# Altium project PCB_Project-LEDs.PrjPCB
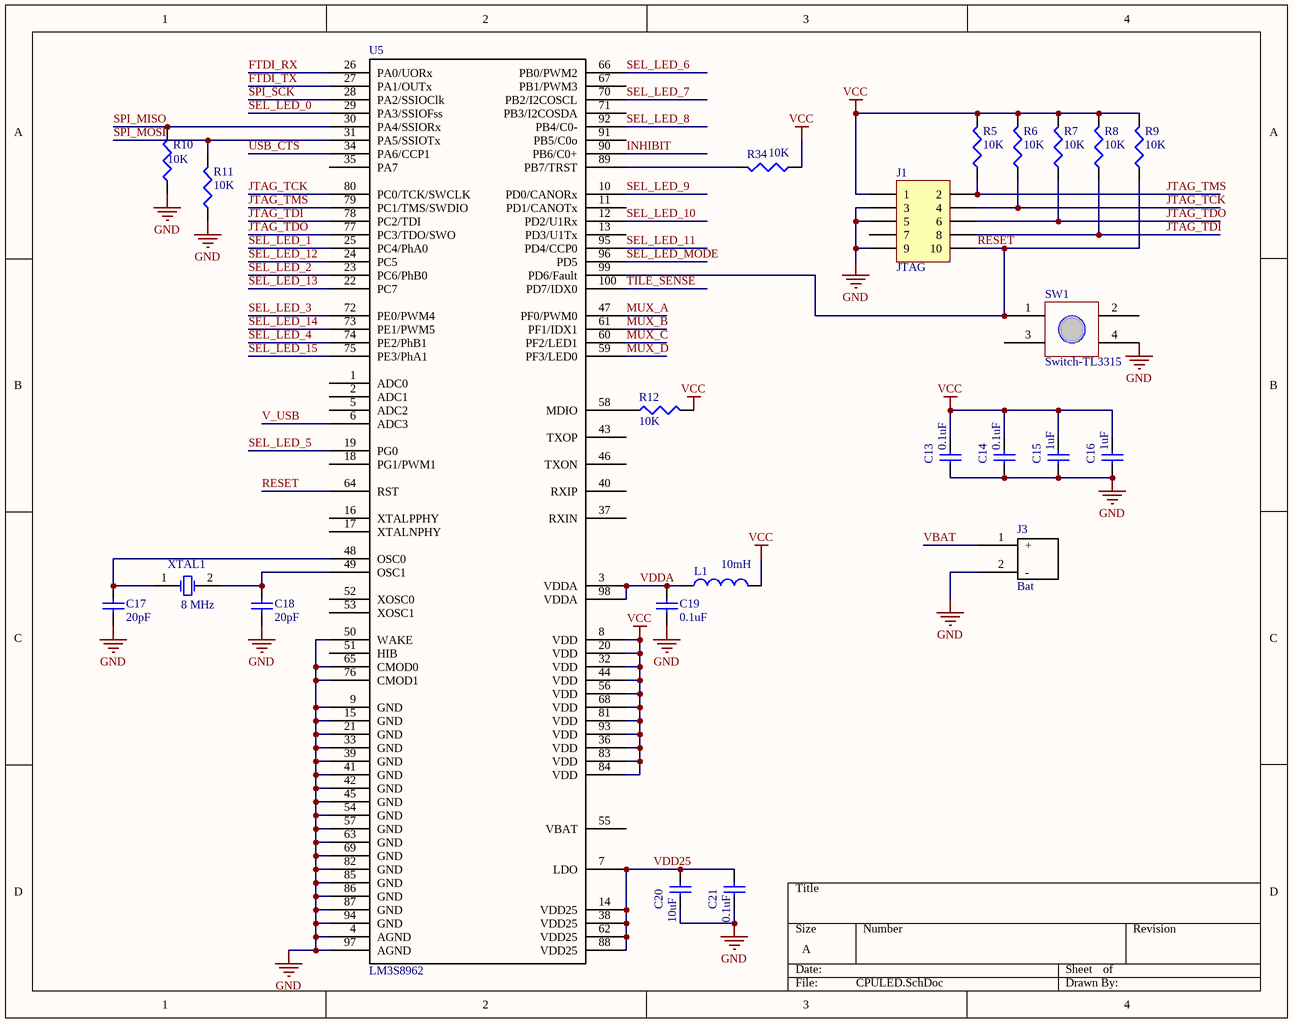
[diagram p0: CPULED.SchDoc]
3 sheets, 66 parts. Net scope: global (net labels, ports and power ports of the same name join across sheets).
Board file: LED_PCB.PcbDoc
Sheets:
  CPULED.SchDoc
  GREENLED.SchDoc
  POWER.SchDoc

## Sheet CPULED.SchDoc
size A

### Parts
C13  value 0.1uF  [CAPC1005L]  (hidden comment: Cap Semi)
C14  value 0.1uF  [CAPC1005L]  (hidden comment: Cap Semi)
C15  value 1uF  [CAPC1608L]  (hidden comment: Cap Semi)
C16  value 1uF  [CAPC1608L]  (hidden comment: Cap Semi)
C17  value 20pF  [CAPC1005L]  (hidden comment: Cap Semi)
C18  value 20pF  [CAPC1005L]  (hidden comment: Cap Semi)
C19  value 0.1uF  [CAPC1005L]  (hidden comment: Cap Semi)
C20  value 10uF  [CAPC1608L]  (hidden comment: Cap Semi)
C21  value 0.1uF  [CAPC1005L]  (hidden comment: Cap Semi)
J1  JTAG  [JTAG-10]
J3  Bat  [BatteryConnJST]
L1  value 10mH  [INDC2012L]  (hidden comment: Inductor)
R5  value 10K  [RESC1608L]  (hidden comment: Res3)
R6  value 10K  [RESC1608L]  (hidden comment: Res3)
R7  value 10K  [RESC1608L]  (hidden comment: Res3)
R8  value 10K  [RESC1608L]  (hidden comment: Res3)
R9  value 10K  [RESC1608L]  (hidden comment: Res3)
R10  value 10K  [RESC1608L]  (hidden comment: Res3)
R11  value 10K  [RESC1608L]  (hidden comment: Res3)
R12  value 10K  [RESC1608L]  (hidden comment: Res3)
R34  value 10K  [RESC1608L]  (hidden comment: Res3)
SW1  Switch-TL3315  [Switch-TL3315]
U5  LM3S8962  [LQFP-100]
XTAL1  8 MHz  [RESC5025L]

### Nets
GND: C13.1 C14.1 C15.1 C16.1 C17.1 C18.1 C19.1 C20.1 C21.1 J1.3 J1.5 J1.9 J3.2(-) R10.1 R11.1 SW1.4 U5.4(AGND) U5.9(GND) U5.15(GND) U5.21(GND) U5.33(GND) U5.39(GND) U5.41(GND) U5.42(GND) U5.45(GND) U5.50(WAKE) U5.54(GND) U5.57(GND) U5.63(GND) U5.65(CMOD0) U5.69(GND) U5.76(CMOD1) U5.82(GND) U5.85(GND) U5.86(GND) U5.87(GND) U5.94(GND) U5.97(AGND)
VCC: C13.2 C14.2 C15.2 C16.2 J1.1 L1.2 R5.2 R6.2 R7.2 R8.2 R9.2 R12.2 R34.1 U5.8(VDD) U5.20(VDD) U5.32(VDD) U5.36(VDD) U5.44(VDD) U5.56(VDD) U5.68(VDD) U5.81(VDD) U5.83(VDD) U5.84(VDD) U5.93(VDD)
FTDI_RX: U5.26(PA0/UORx)
FTDI_TX: U5.27(PA1/OUTx)
INHIBIT: U5.90(PB6/C0+)
JTAG_TCK: J1.4 R6.1 U5.80(PC0/TCK/SWCLK)
JTAG_TDI: J1.8 R8.1 U5.78(PC2/TDI)
JTAG_TDO: J1.6 R7.1 U5.77(PC3/TDO/SWO)
JTAG_TMS: J1.2 R5.1 U5.79(PC1/TMS/SWDIO)
MUX_A: U5.47(PF0/PWM0)
MUX_B: U5.61(PF1/IDX1)
MUX_C: U5.60(PF2/LED1)
MUX_D: U5.59(PF3/LED0)
RESET: J1.10 R9.1 SW1.1 U5.64(RST) U5.99(PD6/Fault)
SEL_LED_0: U5.29(PA3/SSIOFss)
SEL_LED_1: U5.25(PC4/PhA0)
SEL_LED_2: U5.23(PC6/PhB0)
SEL_LED_3: U5.72(PE0/PWM4)
SEL_LED_4: U5.74(PE2/PhB1)
SEL_LED_5: U5.19(PG0)
SEL_LED_6: U5.66(PB0/PWM2)
SEL_LED_7: U5.70(PB2/I2COSCL)
SEL_LED_8: U5.92(PB4/C0-)
SEL_LED_9: U5.10(PD0/CANORx)
SEL_LED_10: U5.12(PD2/U1Rx)
SEL_LED_11: U5.95(PD4/CCP0)
SEL_LED_12: U5.24(PC5)
SEL_LED_13: U5.22(PC7)
SEL_LED_14: U5.73(PE1/PWM5)
SEL_LED_15: U5.75(PE3/PhA1)
SEL_LED_MODE: U5.96(PD5)
SPI_MISO: R10.2 U5.30(PA4/SSIORx)
SPI_MOSI: R11.2 U5.31(PA5/SSIOTx)
SPI_SCK: U5.28(PA2/SSIOClk)
TILE_SENSE: U5.100(PD7/IDX0)
USB_CTS: U5.34(PA6/CCP1)
V_USB: U5.6(ADC3)
VBAT: J3.1(+)
VDD25: C20.2 C21.2 U5.7(LDO) U5.14(VDD25) U5.38(VDD25) U5.62(VDD25) U5.88(VDD25)
VDDA: C19.2 L1.1 U5.3(VDDA) U5.98(VDDA)
NetC17_2: C17.2 U5.48(OSC0) XTAL1.1(OSC1)
NetC18_2: C18.2 U5.49(OSC1) XTAL1.2(OSC2)
NetR12_1: R12.1 U5.58(MDIO)
NetR34_2: R34.2 U5.89(PB7/TRST)

Not connected (* = marked no-connect by the designer): J1 7; SW1 2 3; U5 1(ADC0) 2(ADC1) 5(ADC2) 11(PD1/CANOTx) 13(PD3/U1Tx) 16(XTALPPHY) 17(XTALNPHY) 18(PG1/PWM1) 35(PA7) 37(RXIN) 40(RXIP) 43(TXOP) 46(TXON) 51(HIB) 52(XOSC0) 53(XOSC1) 55(VBAT) 67(PB1/PWM3) 71(PB3/I2COSDA) 91(PB5/C0o)

### Library data of the parts
C13-C21 = Cap Semi: Capacitor (Semiconductor SIM Model); Published: 8-Jun-2000; LatestRevisionDate: 29-May-2009; LatestRevisionNote: IPC-7351 Footprint Added.; PackageReference: C1206; Publisher: Altium Limited; PackageDescription: Chip Capacitor
J1 = Header 5X2H: Header, 5-Pin, Dual row, Right Angle; LatestRevisionDate: 17-Jul-2002; LatestRevisionNote: Re-released for DXP Platform.; Publisher: Altium Limited
J3 = BatteryConnJST
L1 = Inductor: Code_IEC: 1005; Published: 8-Jun-2000; LatestRevisionDate: 29-May-2009; LatestRevisionNote: IPC-7351 Footprint Added.; PackageReference: 0402-A; Publisher: Altium Limited; PackageDescription: Chip Inductor; Code_JEITA: 0402
R5-R12 R34 = Res3: Resistor; Published: 8-Jun-2000; LatestRevisionDate: 29-May-2009; LatestRevisionNote: IPC-7351 Footprint Added.; PackageReference: J1-0603; Publisher: Altium Limited; PackageDescription: Chip Resistor
XTAL1 = XTAL: Crystal Oscillator; Published: 8-Jun-2000; LatestRevisionDate: 17-Jul-2002; LatestRevisionNote: Re-released for DXP Platform.; PackageReference: R38; Publisher: Altium Limited

## Sheet GREENLED.SchDoc
size A
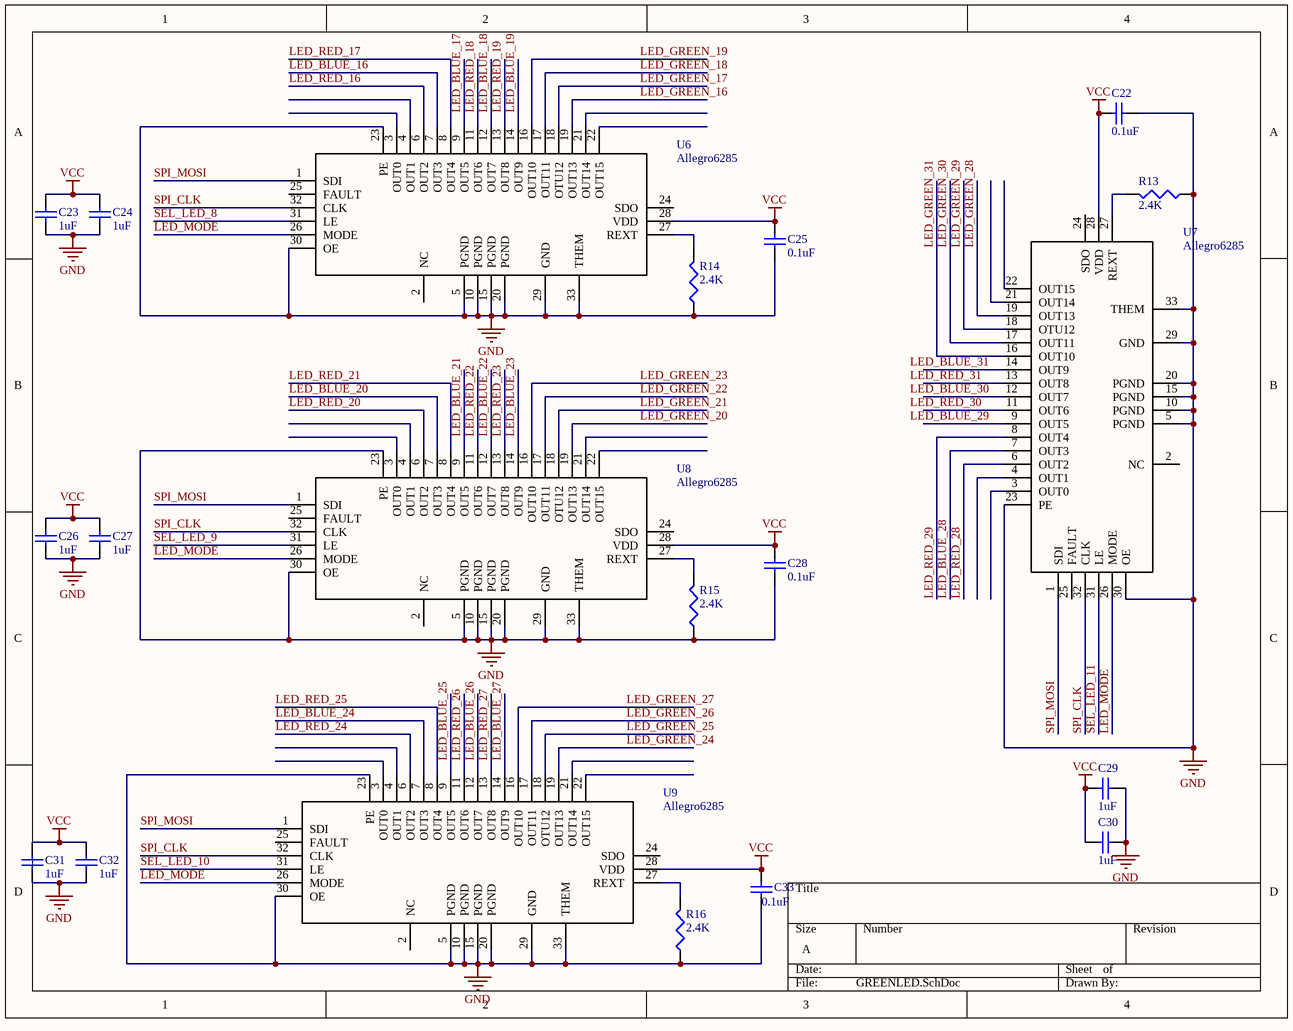
[diagram p1: GREENLED.SchDoc]

### Parts
C22  value 0.1uF  [CAPC1005L]  (hidden comment: Cap Semi)
C23  value 1uF  [CAPC1608L]  (hidden comment: Cap Semi)
C24  value 1uF  [CAPC1608L]  (hidden comment: Cap Semi)
C25  value 0.1uF  [CAPC1005L]  (hidden comment: Cap Semi)
C26  value 1uF  [CAPC1608L]  (hidden comment: Cap Semi)
C27  value 1uF  [CAPC1608L]  (hidden comment: Cap Semi)
C28  value 0.1uF  [CAPC1005L]  (hidden comment: Cap Semi)
C29  value 1uF  [CAPC1608L]  (hidden comment: Cap Semi)
C30  value 1uF  [CAPC1608L]  (hidden comment: Cap Semi)
C31  value 1uF  [CAPC1608L]  (hidden comment: Cap Semi)
C32  value 1uF  [CAPC1608L]  (hidden comment: Cap Semi)
C33  value 0.1uF  [CAPC1005L]  (hidden comment: Cap Semi)
R13  value 2.4K  [RESC1608L]  (hidden comment: Res3)
R14  value 2.4K  [RESC1608L]  (hidden comment: Res3)
R15  value 2.4K  [RESC1608L]  (hidden comment: Res3)
R16  value 2.4K  [RESC1608L]  (hidden comment: Res3)
U6  Allegro6285  [QFN-32]
U7  Allegro6285  [QFN-32]
U8  Allegro6285  [QFN-32]
U9  Allegro6285  [QFN-32]

### Nets
GND: C22.1 C23.1 C24.1 C25.1 C26.1 C27.1 C28.1 C29.1 C30.1 C31.1 C32.1 C33.1 R13.1 R14.1 R15.1 R16.1 U6.5(PGND) U6.10(PGND) U6.15(PGND) U6.20(PGND) U6.23(PE) U6.29(GND) U6.30(OE) U6.33(THEM) U7.5(PGND) U7.10(PGND) U7.15(PGND) U7.20(PGND) U7.23(PE) U7.29(GND) U7.30(OE) U7.33(THEM) U8.5(PGND) U8.10(PGND) U8.15(PGND) U8.20(PGND) U8.23(PE) U8.29(GND) U8.30(OE) U8.33(THEM) U9.5(PGND) U9.10(PGND) U9.15(PGND) U9.20(PGND) U9.23(PE) U9.29(GND) U9.30(OE) U9.33(THEM)
VCC: C22.2 C23.2 C24.2 C25.2 C26.2 C27.2 C28.2 C29.2 C30.2 C31.2 C32.2 C33.2 U6.28(VDD) U7.28(VDD) U8.28(VDD) U9.28(VDD)
LED_BLUE_16: U6.7(OUT3)
LED_BLUE_17: U6.9(OUT5)
LED_BLUE_18: U6.12(OUT7)
LED_BLUE_19: U6.14(OUT9)
LED_BLUE_20: U8.7(OUT3)
LED_BLUE_21: U8.9(OUT5)
LED_BLUE_22: U8.12(OUT7)
LED_BLUE_23: U8.14(OUT9)
LED_BLUE_24: U9.7(OUT3)
LED_BLUE_25: U9.9(OUT5)
LED_BLUE_26: U9.12(OUT7)
LED_BLUE_27: U9.14(OUT9)
LED_BLUE_28: U7.7(OUT3)
LED_GREEN_16: U6.19(OUT13)
LED_GREEN_17: U6.18(OTU12)
LED_GREEN_18: U6.17(OUT11)
LED_GREEN_19: U6.16(OUT10)
LED_GREEN_20: U8.19(OUT13)
LED_GREEN_21: U8.18(OTU12)
LED_GREEN_22: U8.17(OUT11)
LED_GREEN_23: U8.16(OUT10)
LED_GREEN_24: U9.19(OUT13)
LED_GREEN_25: U9.18(OTU12)
LED_GREEN_26: U9.17(OUT11)
LED_GREEN_27: U9.16(OUT10)
LED_GREEN_28: U7.19(OUT13)
LED_GREEN_29: U7.18(OTU12)
LED_GREEN_30: U7.17(OUT11)
LED_GREEN_31: U7.16(OUT10)
LED_MODE: U6.26(MODE) U7.26(MODE) U8.26(MODE) U9.26(MODE)
LED_RED_16: U6.6(OUT2)
LED_RED_17: U6.8(OUT4)
LED_RED_18: U6.11(OUT6)
LED_RED_19: U6.13(OUT8)
LED_RED_20: U8.6(OUT2)
LED_RED_21: U8.8(OUT4)
LED_RED_22: U8.11(OUT6)
LED_RED_23: U8.13(OUT8)
LED_RED_24: U9.6(OUT2)
LED_RED_25: U9.8(OUT4)
LED_RED_26: U9.11(OUT6)
LED_RED_27: U9.13(OUT8)
LED_RED_28: U7.6(OUT2)
LED_RED_29: U7.8(OUT4)
SEL_LED_8: U6.31(LE)
SEL_LED_9: U8.31(LE)
SEL_LED_10: U9.31(LE)
SEL_LED_11: U7.31(LE)
SPI_CLK: U6.32(CLK) U7.32(CLK) U8.32(CLK) U9.32(CLK)
SPI_MOSI: U6.1(SDI) U7.1(SDI) U8.1(SDI) U9.1(SDI)
NetR13_2: R13.2 U7.27(REXT)
NetR14_2: R14.2 U6.27(REXT)
NetR15_2: R15.2 U8.27(REXT)
NetR16_2: R16.2 U9.27(REXT)

Not connected (* = marked no-connect by the designer): U6 2(NC) 3(OUT0) 4(OUT1) 21(OUT14) 22(OUT15) 24(SDO) 25(FAULT); U7 2(NC) 3(OUT0) 4(OUT1) 9(OUT5) 11(OUT6) 12(OUT7) 13(OUT8) 14(OUT9) 21(OUT14) 22(OUT15) 24(SDO) 25(FAULT); U8 2(NC) 3(OUT0) 4(OUT1) 21(OUT14) 22(OUT15) 24(SDO) 25(FAULT); U9 2(NC) 3(OUT0) 4(OUT1) 21(OUT14) 22(OUT15) 24(SDO) 25(FAULT)

### Notes on the sheet
- Labels drawn without touching a wire or pin: LED_BLUE_29, LED_BLUE_30, LED_BLUE_31, LED_RED_30, LED_RED_31

### Library data of the parts
C22-C33 = Cap Semi: Capacitor (Semiconductor SIM Model); Published: 8-Jun-2000; LatestRevisionDate: 29-May-2009; LatestRevisionNote: IPC-7351 Footprint Added.; PackageReference: C1206; Publisher: Altium Limited; PackageDescription: Chip Capacitor
R13-R16 = Res3: Resistor; Published: 8-Jun-2000; LatestRevisionDate: 29-May-2009; LatestRevisionNote: IPC-7351 Footprint Added.; PackageReference: J1-0603; Publisher: Altium Limited; PackageDescription: Chip Resistor

## Sheet POWER.SchDoc
size A
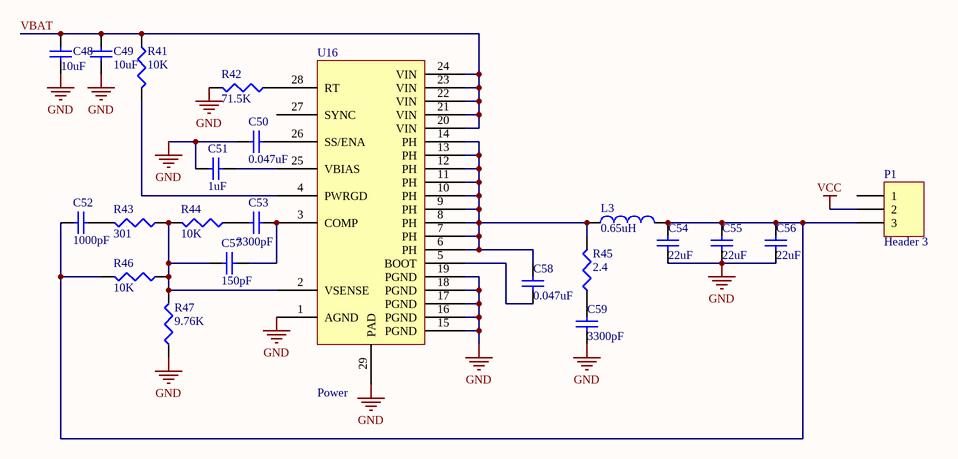
[diagram p2: POWER.SchDoc]

### Parts
C48  value 10uF  [CAPC1005L]  (hidden comment: Cap Semi)
C49  value 10uF  [CAPC1005L]  (hidden comment: Cap Semi)
C50  value 0.047uF  [CAPC1005L]  (hidden comment: Cap Semi)
C51  value 1uF  [CAPC1005L]  (hidden comment: Cap Semi)
C52  value 1000pF  [CAPC1005L]  (hidden comment: Cap Semi)
C53  value 3300pF  [CAPC1005L]  (hidden comment: Cap Semi)
C54  value 22uF  [CAPC1005L]  (hidden comment: Cap Semi)
C55  value 22uF  [CAPC1005L]  (hidden comment: Cap Semi)
C56  value 22uF  [CAPC1005L]  (hidden comment: Cap Semi)
C57  value 150pF  [CAPC1005L]  (hidden comment: Cap Semi)
C58  value 0.047uF  [CAPC1005L]  (hidden comment: Cap Semi)
C59  value 3300pF  [CAPC1005L]  (hidden comment: Cap Semi)
L3  0.65uH  [IndPow]
P1  Header 3  [HDR1X3]
R41  value 10K  [RESC1608L]  (hidden comment: Res3)
R42  value 71.5K  [RESC1608L]  (hidden comment: Res3)
R43  value 301  [RESC1608L]  (hidden comment: Res3)
R44  value 10K  [RESC1608L]  (hidden comment: Res3)
R45  value 2.4  [RESC1608L]  (hidden comment: Res3)
R46  value 10K  [RESC1608L]  (hidden comment: Res3)
R47  value 9.76K  [RESC1608L]  (hidden comment: Res3)
U16  Power  [TSOP_28_PowerPad]

### Nets
GND: C48.2 C49.2 C50.2 C51.2 C54.1 C55.1 C56.1 C59.1 R42.2 R47.1 U16.1(AGND) U16.15(PGND) U16.16(PGND) U16.17(PGND) U16.18(PGND) U16.19(PGND) U16.29(PAD)
VCC: P1.2
VBAT: C48.1 C49.1 R41.1 U16.20(VIN) U16.21(VIN) U16.22(VIN) U16.23(VIN) U16.24(VIN)
NetC50_1: C50.1 U16.26(SS/ENA)
NetC51_1: C51.1 U16.25(VBIAS)
NetC52_1: C52.1 C54.2 C55.2 C56.2 L3.2 P1.3 R46.2
NetC52_2: C52.2 R43.2
NetC53_1: C53.1 C57.1 U16.3(COMP)
NetC53_2: C53.2 R44.1
NetC57_2: C57.2 R43.1 R44.2 R46.1 R47.2 U16.2(VSENSE)
NetC58_1: C58.1 U16.5(BOOT)
NetC58_2: C58.2 L3.1 R45.2 U16.6(PH) U16.7(PH) U16.8(PH) U16.9(PH) U16.10(PH) U16.11(PH) U16.12(PH) U16.13(PH) U16.14(PH)
NetC59_2: C59.2 R45.1
NetR41_2: R41.2 U16.4(PWRGD)
NetR42_1: R42.1 U16.28(RT)

Not connected (* = marked no-connect by the designer): P1 1; U16 27(SYNC)

### Library data of the parts
C48-C59 = Cap Semi: Capacitor (Semiconductor SIM Model); Published: 8-Jun-2000; LatestRevisionDate: 29-May-2009; LatestRevisionNote: IPC-7351 Footprint Added.; PackageReference: C1206; Publisher: Altium Limited; PackageDescription: Chip Capacitor
L3 = Inductor: Value: 0.65uH
P1 = Header 3: Header, 3-Pin; LatestRevisionDate: 17-Jul-2002; LatestRevisionNote: Re-released for DXP Platform.; Publisher: Altium Limited
R41-R47 = Res3: Resistor; Published: 8-Jun-2000; LatestRevisionDate: 29-May-2009; LatestRevisionNote: IPC-7351 Footprint Added.; PackageReference: J1-0603; Publisher: Altium Limited; PackageDescription: Chip Resistor
U16 = Power_Switcher

## Nets that join several sheets
GND: CPULED (38 pins), GREENLED (48 pins), POWER (17 pins)
VCC: CPULED (24 pins), GREENLED (16 pins), POWER (P1.2)
SEL_LED_8: CPULED (U5.92), GREENLED (U6.31)
SEL_LED_9: CPULED (U5.10), GREENLED (U8.31)
SEL_LED_10: CPULED (U5.12), GREENLED (U9.31)
SEL_LED_11: CPULED (U5.95), GREENLED (U7.31)
SPI_MOSI: CPULED (R11.2 U5.31), GREENLED (U6.1 U7.1 U8.1 U9.1)
VBAT: CPULED (J3.1), POWER (8 pins)